# EAGLE design STEP-CON Mk 04 (EAGLE 7.6.0)
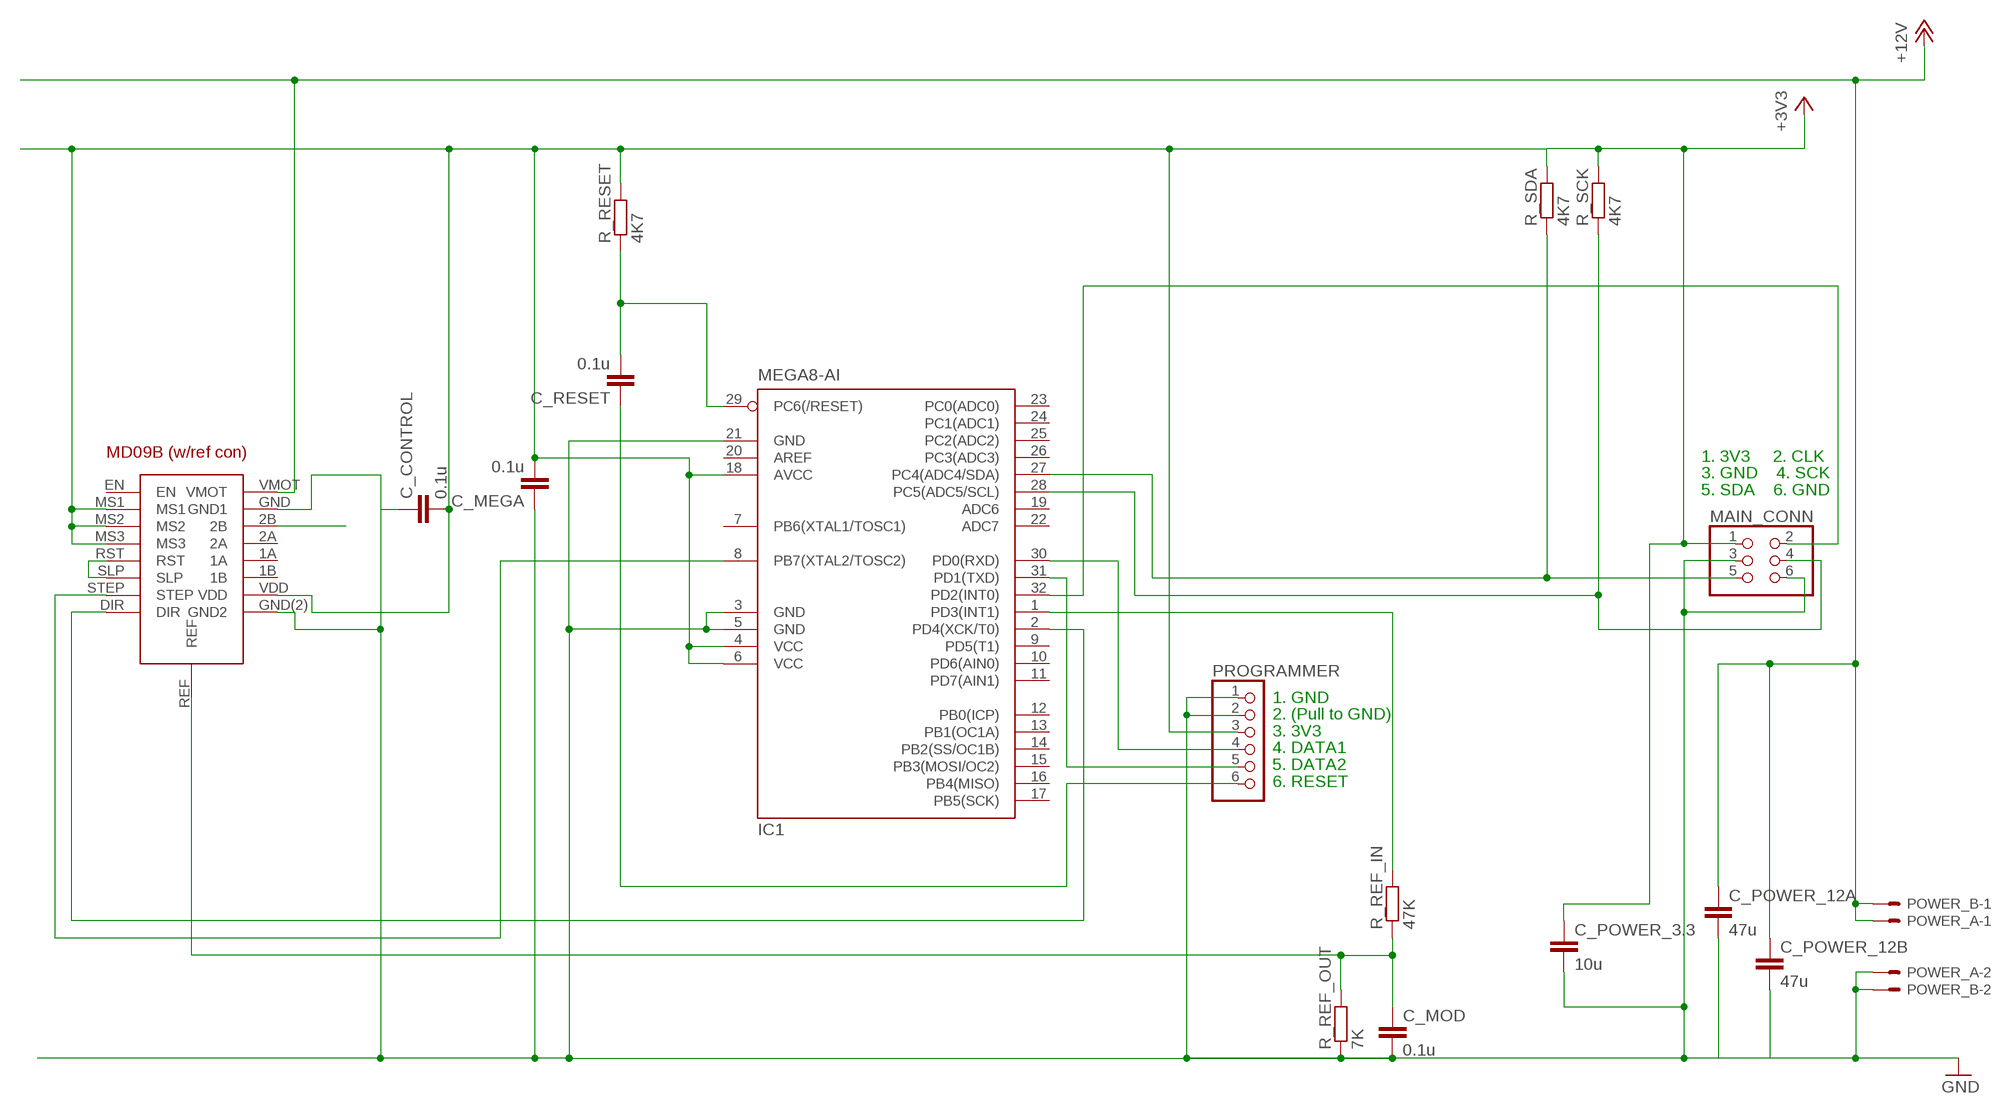
[diagram p0: schematic, sheet 1]

## Parts
C_CONTROL  0.1u  C-EUC1206  [C1206]
C_MEGA  0.1u  C-EUC1206  [C1206]
C_MOD  0.1u  C-EUC1206  [C1206]
C_POWER_3.3  10u  C-EUC1206  [C1206]
C_POWER_12A  47u  C-EUC1206  [C1206]
C_POWER_12B  47u  C-EUC1206  [C1206]
C_RESET  0.1u  C-EUC1206  [C1206]
IC1  MEGA8-AI  [TQFP32-08]
MAIN_CONN  PINHD-2X3  [2X03]
POWER_A  KK-156-2  [KK-156-2]
POWER_B  KK-156-2  [KK-156-2]
PROGRAMMER  PINHD-1X6  [1X06]
R_REF_IN  47K  R-EU_M0805  [M0805]
R_REF_OUT  7K  R-EU_M0805  [M0805]
R_RESET  4K7  R-EU_M0805  [M0805]
R_SCK  4K7  R-EU_M0805  [M0805]
R_SDA  4K7  R-EU_M0805  [M0805]
U$1  MD09B_MOD_LP  [MD90B_MOD_LP]

## Nets
2B: U$1.2B
+3V3: C_CONTROL.2 C_MEGA.2 C_POWER_3.3.1 IC1.4(VCC) IC1.6(VCC) IC1.18(AVCC) MAIN_CONN.1 PROGRAMMER.3 R_RESET.2 R_SCK.2 R_SDA.2 U$1.MS1 U$1.MS2 U$1.MS3 U$1.VDD
+12V: C_POWER_12A.1 C_POWER_12B.1 POWER_A.1 POWER_B.1 U$1.VMOT
DATA1: IC1.30(PD0(RXD)) PROGRAMMER.4
DATA2: IC1.31(PD1(TXD)) PROGRAMMER.5
DIR: IC1.2(PD4(XCK/T0)) U$1.DIR
GND: C_CONTROL.1 C_MEGA.1 C_MOD.2 C_POWER_3.3.2 C_POWER_12A.2 C_POWER_12B.2 IC1.3(GND) IC1.5(GND) IC1.21(GND) MAIN_CONN.3 MAIN_CONN.6 POWER_A.2 POWER_B.2 PROGRAMMER.1 PROGRAMMER.2 R_REF_OUT.1 U$1.GND(2)(GND2) U$1.GND(GND1)
PWM: IC1.1(PD3(INT1)) R_REF_IN.2
REF: C_MOD.1 R_REF_IN.1 R_REF_OUT.2 U$1.REF
RESET: C_RESET.2 IC1.29(PC6(/RESET)) R_RESET.1
RESET_INPUT: C_RESET.1 PROGRAMMER.6
RST_SLP: U$1.RST U$1.SLP
SCK: IC1.28(PC5(ADC5/SCL)) MAIN_CONN.4 R_SCK.1
SDA: IC1.27(PC4(ADC4/SDA)) MAIN_CONN.5 R_SDA.1
SKYCLOCK: IC1.32(PD2(INT0)) MAIN_CONN.2
STEP: IC1.8(PB7(XTAL2/TOSC2)) U$1.STEP
Unconnected: IC1.7(PB6(XTAL1/TOSC1)) IC1.9(PD5(T1)) IC1.10(PD6(AIN0)) IC1.11(PD7(AIN1)) IC1.12(PB0(ICP)) IC1.13(PB1(OC1A)) IC1.14(PB2(SS/OC1B)) IC1.15(PB3(MOSI/OC2)) IC1.16(PB4(MISO)) IC1.17(PB5(SCK)) IC1.19(ADC6) IC1.20(AREF) IC1.22(ADC7) IC1.23(PC0(ADC0)) IC1.24(PC1(ADC1)) IC1.25(PC2(ADC2)) IC1.26(PC3(ADC3)) U$1.1A U$1.1B U$1.2A U$1.EN

## Notes on the sheet
- 1. 3V3     2. CLK
  3. GND    4. SCK
  5. SDA    6. GND
- 1. GND
  2. (Pull to GND)
  3. 3V3
  4. DATA1
  5. DATA2
  6. RESET

## Library data of the parts
C_CONTROL C_MEGA C_MOD C_POWER_3.3 C_POWER_12A C_POWER_12B C_RESET = rcl:C-EU: CAPACITOR, European symbol
IC1 = atmel:MEGA8: MICROCONTROLLER 8 Kbytes FLASH, 1 kbytes SRAM, 512 bytes EEPROM, USART, 6-channel 10 bit ADC, 2-channel 8 bit ADC Pin compatible with Atmega48, ATMega88, ATMega168 Source: avr.lbr; MPN: ATMEGA8-16AU; OC_FARNELL: 9171371; OC_NEWARK: 73M8863
MAIN_CONN = pinhead - big pad:PINHD-2X3: PIN HEADER
POWER_A POWER_B = con-molex:KK-156-2: KK 156 HEADER Source: http://www.molex.com/pdm_docs/sd/026604100_sd.pdf; OC_FARNELL: unknown; OC_NEWARK: unknown
PROGRAMMER = pinhead - big pad:PINHD-1X6: PIN HEADER
R_REF_IN R_REF_OUT R_RESET R_SCK R_SDA = rcl:R-EU_: RESISTOR, European symbol
U$1 = pololu:MD09B_MOD_LP

## Board
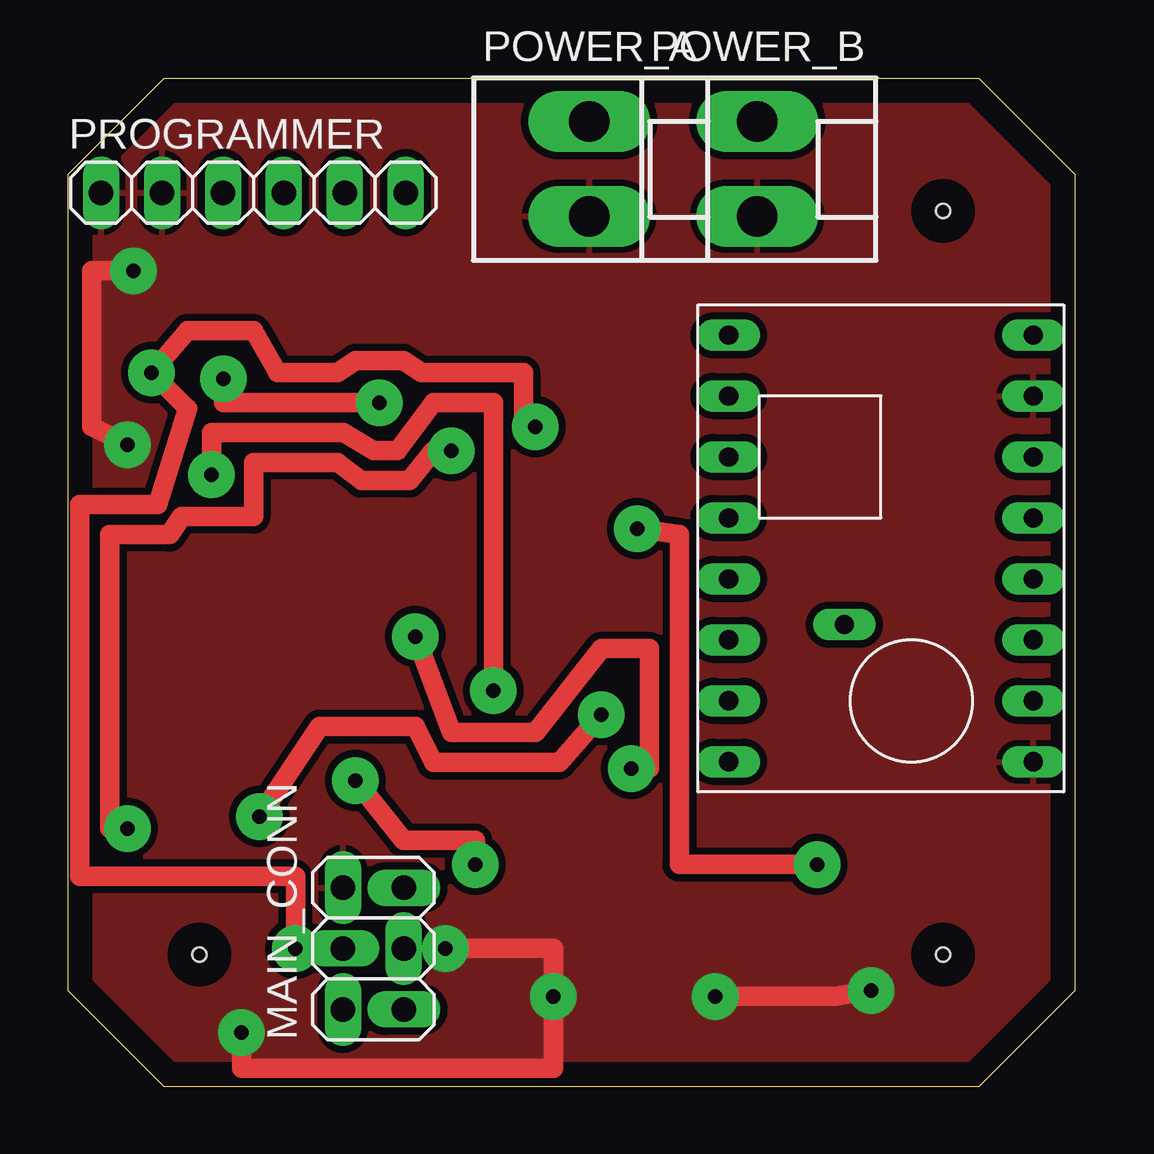
[diagram p1: board, top side]
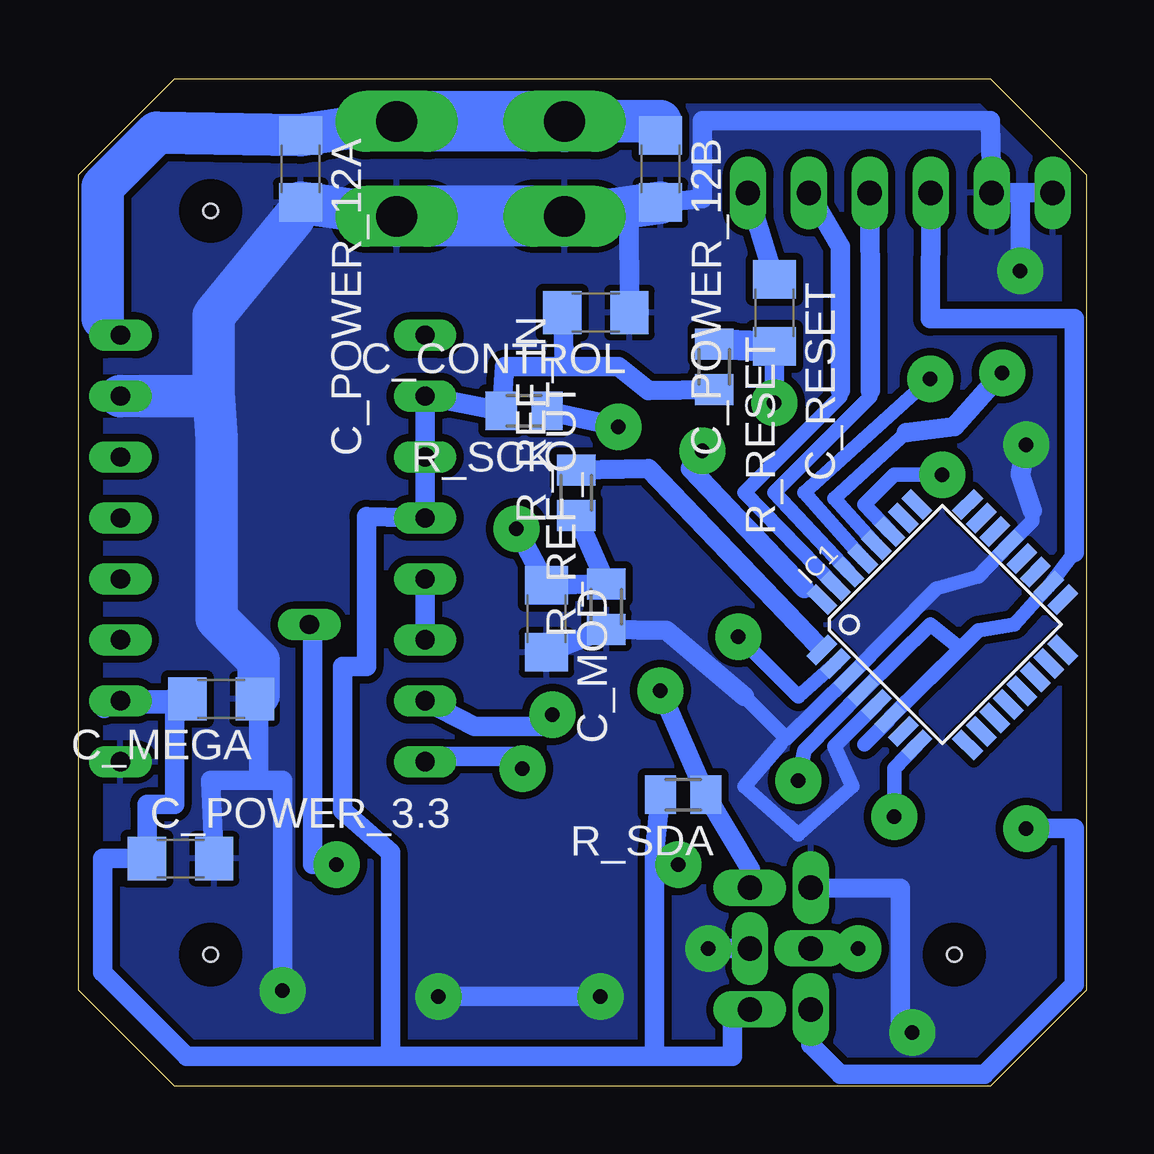
[diagram p2: board, bottom side, seen from below]

Size 42 x 42 mm. Coordinates in mm from the lower left corner, seen from the top.
Outline: 4,0 38,0 42,4 42,38 38,42 4,42 0,38 0,4 4,0
Copper layers (1*16): Top 0.035mm / dielectric 1.5mm / Bottom 0.035mm
Design rules "default *": minimum track width 10mil, minimum drill 24mil, track to track 12mil, track to pad 12mil, pad to pad 12mil, via to via 12mil, smd to smd 8mil, copper to edge 40mil, drill to drill 12mil, minimum pad ring 10mil, minimum via ring 8mil, stop-mask expansion 4mil, vias tented up to drill 0mil, thermal gap 10mil
Holes 0.6 mm at 5.5,5.5 36.5,36.5 36.5,5.5

### Footprints (pad centres in the part's own frame; a part is rotated, then mirrored left to right if it is on the bottom)
C1206 = smd 1.6 x 1.8: 1 -1.4,0; 2 1.4,0
TQFP32-08 = smd 1.27 x 0.559: 1 -4.293,2.8; 2 -4.293,2; 3 -4.293,1.2; 4 -4.293,0.4; 5 -4.293,-0.4; 6 -4.293,-1.2; 7 -4.293,-2; 8 -4.293,-2.8; 17 4.293,-2.8; 18 4.293,-2; 19 4.293,-1.2; 20 4.293,-0.4; 21 4.293,0.4; 22 4.293,1.2; 23 4.293,2; 24 4.293,2.8 | smd 0.559 x 1.27: 9 -2.8,-4.293; 10 -2,-4.293; 11 -1.2,-4.293; 12 -0.4,-4.293; 13 0.4,-4.293; 14 1.2,-4.293; 15 2,-4.293; 16 2.8,-4.293; 25 2.8,4.293; 26 2,4.293; 27 1.2,4.293; 28 0.4,4.293; 29 -0.4,4.293; 30 -1.2,4.293; 31 -2,4.293; 32 -2.8,4.293
2X03 = drill 1.016 long: 1 -2.54,-1.27; 2 -2.54,1.27; 3 0,-1.27; 4 0,1.27; 5 2.54,-1.27; 6 2.54,1.27
KK-156-2 = drill 1.7 pad 2.184 long: 1 -1.98,0; 2 1.98,0
1X06 = drill 1.016 long: 1 -6.35,0; 2 -3.81,0; 3 -1.27,0; 4 1.27,0; 5 3.81,0; 6 6.35,0
M0805 = smd 1.3 x 1.6: 1 -0.95,0; 2 0.95,0
MD90B_MOD_LP = drill 0.8 long: 1A 6.35,-1.27; 1B 6.35,-3.81; 2A 6.35,1.27; 2B 6.35,3.81; DIR -6.35,-8.89; EN -6.35,8.89; GND 6.35,6.35; GND(2) 6.35,-8.89; MS1 -6.35,6.35; MS2 -6.35,3.81; MS3 -6.35,1.27; REF -1.524,-3.175; RST -6.35,-1.27; SLP -6.35,-3.81; STEP -6.35,-6.35; VDD 6.35,-6.35; VMOT 6.35,8.89

### Placement (x,y rotation side)
C_CONTROL  20.44,32.26 180 bottom
C_MEGA  36.06,16.16 180 bottom
C_MOD  22.5,19.5 270 bottom
C_POWER_3.3  37.75,9.5 0 bottom
C_POWER_12A  32.75,38.25 270 bottom
C_POWER_12B  17.75,38.25 270 bottom
C_RESET  13,32.25 270 bottom
IC1  6,19.25 45 bottom
MAIN_CONN  12.75,5.75 90 top
POWER_A  21.75,38.25 270 top
POWER_B  28.75,38.25 270 top
PROGRAMMER  7.75,37.25 0 top
R_REF_IN  21.25,24.75 90 bottom
R_REF_OUT  20,20 90 bottom
R_RESET  15.5,30 270 bottom
R_SCK  23.43,28.16 180 bottom
R_SDA  16.8,12.16 180 bottom
U$1  33.91,22.43 0 top

### Tracks (layer width: path | path; a pad name or v marks a point on that pad's centre or on a via)
+3V3  (via drill 0.6 pad 1.93)
  Top 0.813: v12,12.75 14,10.25 17,10.25 v17,9.25
  Bottom 0.254: 18,1.5 18.25,1.25
  Bottom 0.406: 5.25,18.25 6,17.5 | U$1.VDD 40.94,16.08 40.94,15.76 38,15.76
  Bottom 0.61: 0.5,22.25 IC1.18 3,19.25 4.5,19 5.25,18.25 | 6,17.5 IC1.6 5.25,18.25 | 5.25,18.25 6.5,19.25 IC1.4 11.75,14 v12,12.75
  Bottom 0.813: 40.94,15.76 40.92,16.08 C_MEGA.2 | 29,1.25 37.5,1.25 41,4.75 41,9.5 C_POWER_3.3.1 39.15,11.75 38,11.75 38,15.76 | 29,1.25 18.25,1.25 14.75,1.25 14.75,3.23 MAIN_CONN.1 | 29,1.25 29,9.75 31,11.5 31,17.5 30,17.5 30,23.75 U$1.MS3 U$1.MS2 U$1.MS1 R_SCK.2 24.25,30 21.75,30 | 0.5,22.25 0.5,32 6.5,32 PROGRAMMER.3 | C_CONTROL.2 21.75,30 | R_RESET.2 18.25,29 19.5,30 21.5,30 21.75,30 | R_SDA.2 18,9.75 | 18,9.75 18,1.5 | v17,9.25 18,9.75
+12V
  Bottom 0.254: 17.75,40.23 C_POWER_12B.1
  Bottom 0.813: U$1.VMOT 40.32,31.32 41,32 | POWER_B.1 28.75,40.25
  Bottom 1.778: 41,32 41,37.5 38.75,39.75 C_POWER_12A.1 28.75,40.25 | 17.75,40.23 POWER_A.1
  Bottom 2.54: 28.75,40.25 POWER_A.1
DATA1
  Bottom 0.406: 9,29 9,28.75
  Bottom 0.61: 9,28.75 13,24.75 IC1.30
  Bottom 0.813: PROGRAMMER.4 9,32.25 9,29
DATA2
  Bottom 0.406: 10.25,28.75 10.25,29
  Bottom 0.61: IC1.31 14.25,24.75 10.25,28.75
  Bottom 0.813: 10.25,29 10.25,35 PROGRAMMER.5
DIR  (via drill 0.6 pad 1.93)
  Top 0.813: v14.5,18.75 16,14.75 19.5,14.75 22.25,18.25 24.25,18.25 24.25,13.25 v23.5,13.25
  Bottom 0.61: IC1.2 12,16.25 v14.5,18.75
  Bottom 0.813: v23.5,13.25 23.75,13.75 27.5,13.75 U$1.DIR
GND  (via drill 0.6 pad 1.93)
  Top 0.813: v15.75,5.75 20.25,5.75 v20.25,3.75 20.25,0.75 7.25,0.75 v7.25,2.25 | v27,3.75 32,3.75 v33.5,4 | v2.5,26.75 1,27.5 1,34 v2.75,34
  Bottom 0.254: 16,6.5 v15.75,5.75
  Bottom 0.406: 12.5,14.5 12.75,14.25
  Bottom 0.61: 12.75,14.25 14.25,12.5 12,10.5 9.75,12.5 10.5,14.18 IC1.5 | 2.25,24 2.25,23.57 IC1.21 4.5,21.25 6.25,20.75 IC1.3 12.5,14.5 14.25,16.25
  Bottom 0.813: 36.72,28.78 36.38,28.88 | 34.5,16.32 C_MEGA.1 34.5,16 34.5,12.75 | 34.5,12.75 36.5,12.75 C_POWER_3.3.2 | MAIN_CONN.3 v15.75,5.75 | v33.5,4 33.5,12.75 34.5,12.75 | 2.75,37.25 PROGRAMMER.2 4,40.25 16,40.25 16,37 C_POWER_12B.2 | 2.75,37.25 PROGRAMMER.1 | 2.25,24 2.75,25.5 v2.5,26.75 | v2.75,34 2.75,37.25 | 14.25,16.25 17.5,19 R_REF_OUT.1 C_MOD.2 | v20.25,3.75 v27,3.75 | v7.25,2.25 7.75,2.75 7.75,8.25 MAIN_CONN.6 | C_CONTROL.1 19.06,36.66
  Bottom 1.778: U$1.GND 36.72,28.78 | 33,36.25 36.38,32.12 36.38,28.88 36.25,27 36.25,19.5 34.5,17.75 34.5,16.32 | POWER_B.2 C_POWER_12A.2 | C_POWER_12B.2 19.06,36.66 POWER_A.2
  Bottom 2.54: POWER_A.2 POWER_B.2
  pour Bottom: 0,4 4,0 38,0 42,4.25 42,37.5 37.75,42 4,42 0,38
  pour Top: 0,4 4,0 38,0 42,4.25 42,37.5 37.75,42 4,42 0,38
N$1
  Bottom 0.61: 8.25,15.25 9.25,14.25
PWM
  Bottom 0.406: IC1.1 11.25,18.45
  Bottom 0.813: 11.25,18.45 12.5,19.75 18.25,25.75 R_REF_IN.2
REF  (via drill 0.6 pad 1.93)
  Top 0.813: v23.75,23.25 25.5,23 25.5,9.25 v31.25,9.25
  Bottom 0.813: R_REF_IN.1 R_REF_OUT.2 C_MOD.1 v23.75,23.25 | v31.25,9.25 32.25,9.25 32.25,19.25 U$1.REF
RESET  (via drill 0.6 pad 1.93)
  Top 0.813: v6.5,29.5 6.5,28.5 v13,28.5
  Bottom 0.61: IC1.29 11.75,24.75 v6.5,29.5
  Bottom 0.813: v13,28.5 C_RESET.2
  Bottom 1.27: R_RESET.1 C_RESET.2
RESET_INPUT
  Bottom 0.813: C_RESET.1 PROGRAMMER.6
RST_SLP
  Bottom 0.813: U$1.RST U$1.SLP
SCK  (via drill 0.6 pad 1.93)
  Top 0.813: v19.5,27.5 19,27.5 19,29.75 14.75,29.75 14,30.25 12,30.25 11.25,29.75 8.75,29.75 7.75,31.5 5,31.5 v3.5,29.75 5,28.25 3.75,24.25 0.5,24.25 0.5,8.75 9.5,8.75 v9.5,5.75
  Bottom 0.61: IC1.28 10.5,24.5 7.5,27.25
  Bottom 0.813: v9.5,5.75 MAIN_CONN.4 | 7.5,27.25 5.5,27.5 v3.5,29.75 | v19.5,27.5 R_SCK.1
SDA  (via drill 0.6 pad 1.93)
  Top 0.813: v6,25.5 6,27.25 11.5,27.25 12.75,26.5 13.75,26.5 15.25,28.5 17.75,28.5 v17.75,16.5
  Bottom 0.61: IC1.27 9.25,24.25 8,25.5 v6,25.5
  Bottom 0.813: MAIN_CONN.5 14,9.06 R_SDA.1 v17.75,16.5
SKYCLOCK  (via drill 0.6 pad 1.93)
  Top 0.813: v16,26.5 15.25,26.5 14.25,25.25 12.25,25.25 11.25,26 7.75,26 7.75,23.75 4.75,23.75 4.25,23 1.75,23 1.75,10.75 v2.5,10.75
  Bottom 0.406: IC1.32 11.75,20.75
  Bottom 0.813: MAIN_CONN.2 11.48,1.73 10.25,0.5 4.25,0.5 0.5,4.25 0.5,10.75 v2.5,10.75 | 11.75,20.75 16.5,25.75 v16,26.5
STEP  (via drill 0.6 pad 1.93)
  Top 0.813: v8,11.25 10.5,15 14.5,15 15.25,13.5 20.5,13.5 v22.25,15.5
  Bottom 0.61: IC1.8 8,13.25 v8,11.25
  Bottom 0.813: 27.48,16 U$1.STEP 25.5,15 22.75,15 v22.25,15.5